# EAGLE design IMU (EAGLE 6.0)
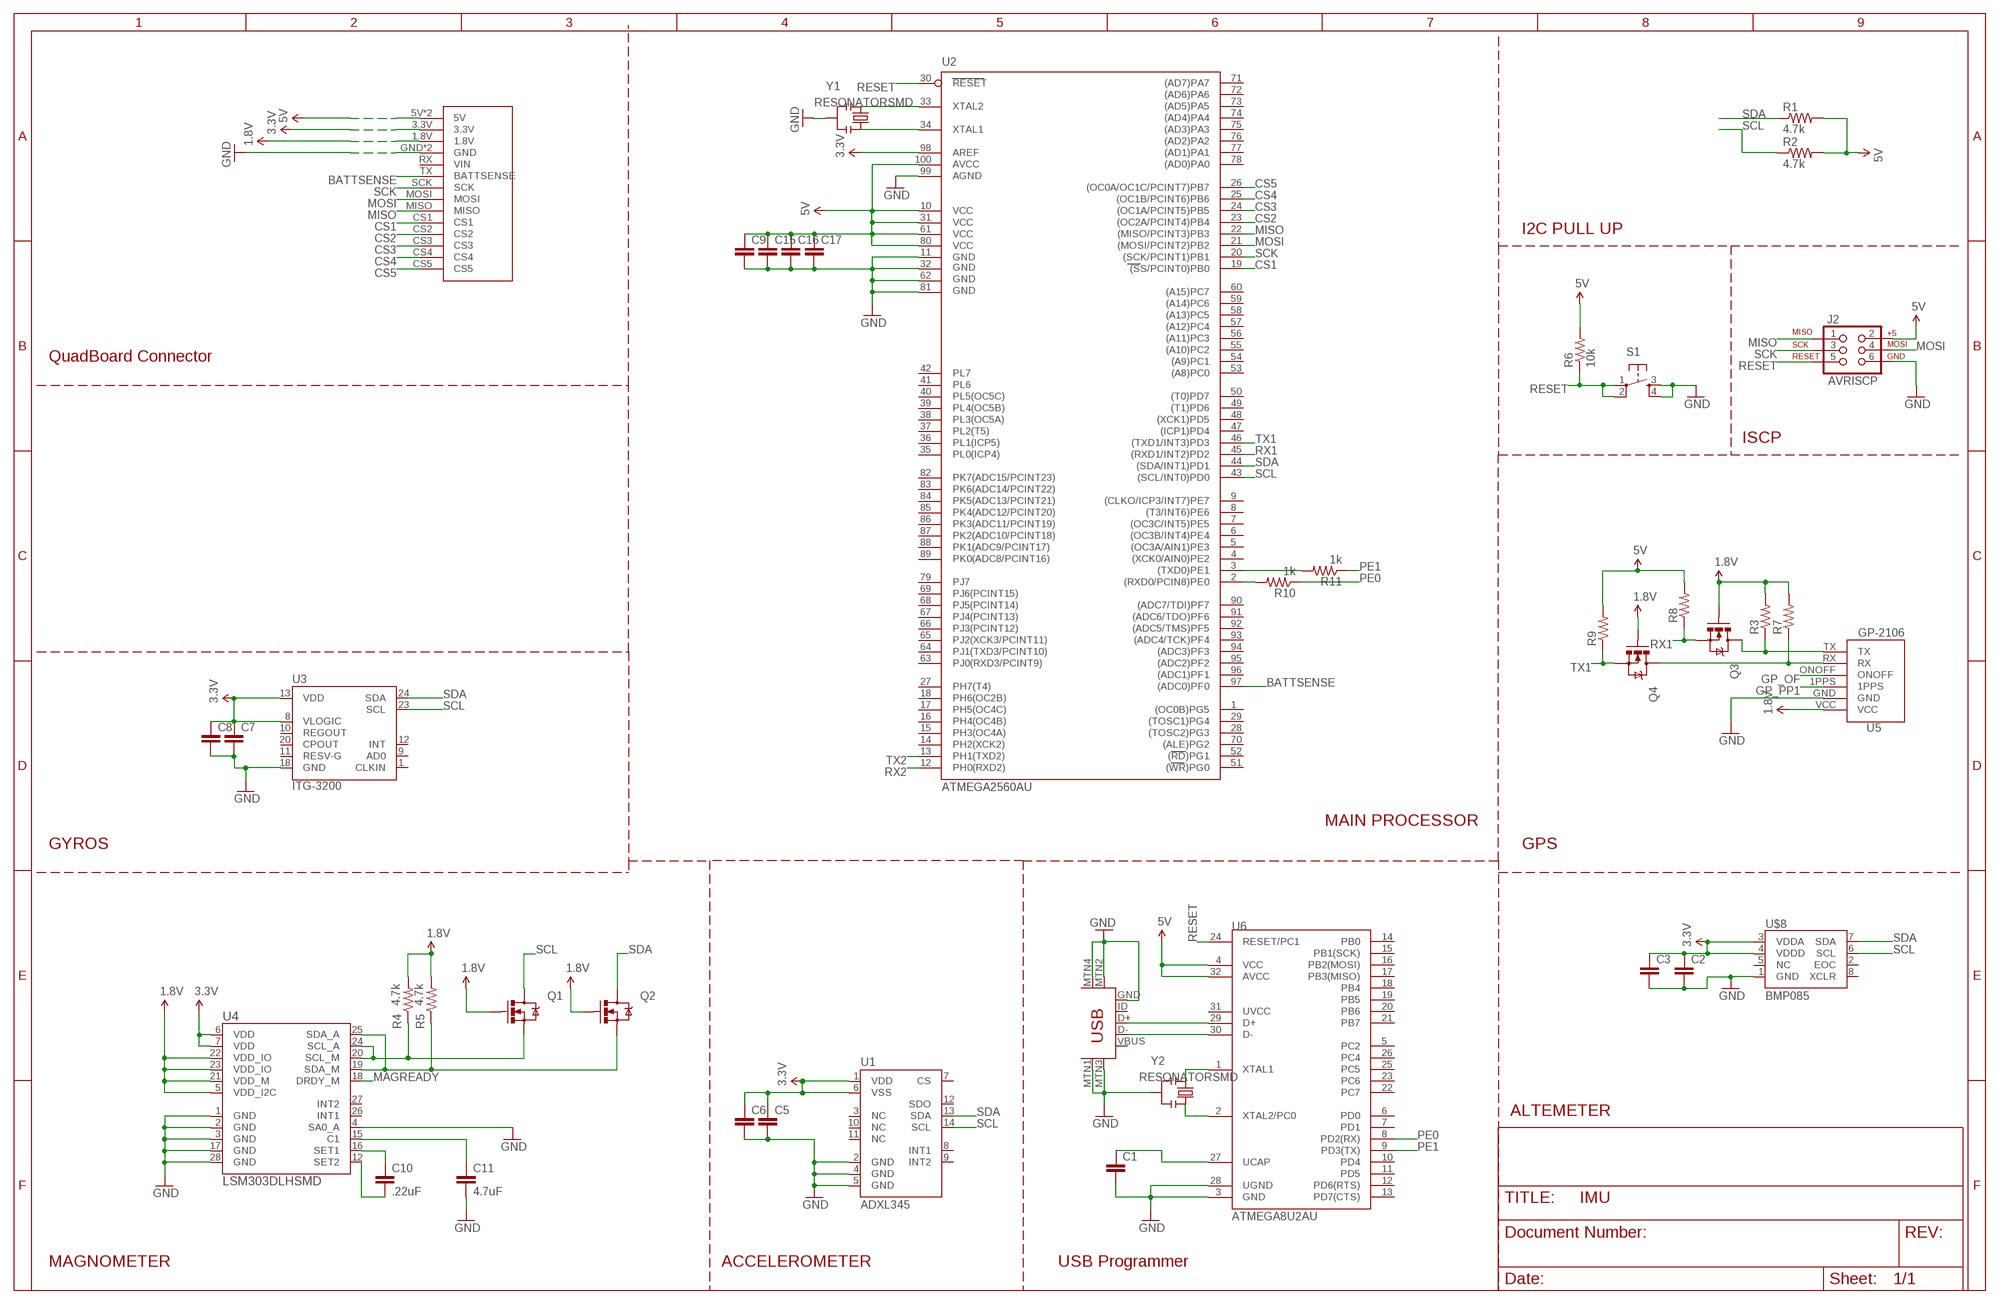
[diagram p0: schematic, sheet 1]

## Parts
C1  CAP0805  [0805]
C2  CAP0805  [0805]
C3  CAP0805  [0805]
C5  CAP0805  [0805]
C6  CAP0805  [0805]
C7  CAP0805  [0805]
C8  CAP0805  [0805]
C9  CAP0805  [0805]
C10  .22uF  CAP0805  [0805]
C11  4.7uF  CAP0805  [0805]
C15  CAP0805  [0805]
C16  CAP0805  [0805]
C17  CAP0805  [0805]
J2  AVRISCP  AVR_SPI_PRG_6PTH  [2X3]
Q1  MOSFET-NCHANNELSMD  [SOT23-3]
Q2  MOSFET-NCHANNELSMD  [SOT23-3]
Q3  MOSFET-NCHANNELSMD  [SOT23-3]
Q4  MOSFET-NCHANNELSMD  [SOT23-3]
R1  4.7k  RESISTOR0805-RES  [0805]
R2  4.7k  RESISTOR0805-RES  [0805]
R3  RESISTOR0805-RES  [0805]
R4  4.7k  RESISTOR0805-RES  [0805]
R5  4.7k  RESISTOR0805-RES  [0805]
R6  10k  RESISTOR0805-RES  [0805]
R7  RESISTOR0805-RES  [0805]
R8  RESISTOR0805-RES  [0805]
R9  RESISTOR0805-RES  [0805]
R10  1k  RESISTOR0805-RES  [0805]
R11  1k  RESISTOR0805-RES  [0805]
S1  TAC_SWITCHSMD  [TACTILE_SWITCH_SMD]
U1  ADXL345  [LGA14]
U2  ATMEGA2560AU  [TQFP100]
U3  ITG-3200  [QFN-24]
U4  LSM303DLHSMD  [LGA28-5X5]
U5  GP-2106  [GP-2106]
U6  ATMEGA8U2AU  [TQFP32-08]
U$1  USB-MINIB-5PIN  [USB-MINIB]
U$4  QUADBOARDEXT  [QUADBOARDEXT]
U$8  BMP085  [BMP085]
Y1  RESONATORSMD  [RESONATOR-SMD]
Y2  RESONATORSMD  [RESONATOR-SMD]

## Nets
1.8V: Q1.1(G) Q2.1(G) Q3.1(G) Q4.1(G) R3.2 R4.2 R5.2 R7.2 U4.5(VDD_I2C) U4.21(VDD_M) U4.22(VDD_IO) U4.23(VDD_IO) U5.VCC U$4.1.8V
3.3V: C2.1 C3.1 C5.1 C6.1 C7.1 C8.1 U1.1(VDD) U1.6(VSS) U2.98(AREF) U3.8(VLOGIC) U3.13(VDD) U4.6(VDD) U4.7(VDD) U$4.3.3V U$8.3(VDDA) U$8.4(VDDD)
5V [POWER]: C9.1 C15.1 C16.1 C17.1 J2.2 R1.2 R2.2 R6.2 R8.2 R9.2 U2.10(VCC) U2.31(VCC1) U2.61(VCC2) U2.80(VCC3) U2.100(AVCC) U6.4(VCC) U6.32(AVCC) U$4.5V U$4.5V1(5V)
BATTSENSE: U2.97((ADC0)PF0) U$4.TX(BATTSENSE)
CS1: U2.19((SS/PCINT0)PB0) U$4.CS1
CS2: U2.23((OC2A/PCINT4)PB4) U$4.CS2
CS3: U2.24((OC1A/PCINT5)PB5) U$4.CS3
CS4: U2.25((OC1B/PCINT6)PB6) U$4.CS4
CS5: U2.26((OC0A/OC1C/PCINT7)PB7) U$4.CS5
GND: C1.2 C2.2 C3.2 C5.2 C6.2 C7.2 C8.2 C9.2 C11.2 C15.2 C16.2 C17.2 J2.6 S1.3 S1.4 U1.2(GND) U1.4(GND) U1.5(GND) U2.11(GND) U2.32(GND1) U2.62(GND2) U2.81(GND3) U2.99(AGND) U3.18(GND) U4.1(GND) U4.2(GND) U4.3(GND) U4.4(SA0_A) U4.17(GND) U4.28(GND) U5.GND U6.3(GND) U6.28(UGND) U$1.GND U$1.MTN1(MTN2) U$1.MTN2(MTN3) U$1.MTN3(MTN1) U$1.MTN4 U$4.GND U$4.GND1(GND) U$8.1(GND) Y1.2 Y2.2
GP_OF: U5.ONOFF
GP_PP1: U5.1PPS
MAGREADY: U4.18(DRDY_M)
MISO: J2.1 U2.22((MISO/PCINT3)PB3) U$4.MISO
MOSI: J2.4 U2.21((MOSI/PCINT2)PB2) U$4.MOSI
N$1: Q2.2(S) R5.1 U4.19(SDA_M) U4.25(SDA_A)
N$2: Q1.2(S) R4.1 U4.20(SCL_M) U4.24(SCL_A)
N$3: C11.1 U4.15(C1)
N$4: C10.1 U4.16(SET1)
N$5: Q3.3(D) R3.1 U5.TX
N$6: Q4.3(D) R7.1 U5.RX
N$7: C10.2 U4.12(SET2)
N$8: U6.1(XTAL1) Y2.1
N$9: U2.33(XTAL2) Y1.1
N$10: U6.2(XTAL2/PC0) Y2.3
N$11: U6.30(D-) U$1.D-
N$12: U2.34(XTAL1) Y1.3
N$13: U6.29(D+) U$1.D+
N$14: R10.2 U2.2((RXD0/PCIN8)PE0)
N$15: R11.2 U2.3((TXD0)PE1)
N$16: C1.1 U6.27(UCAP)
PE0: R10.1 U6.8(PD2(RX))
PE1: R11.1 U6.9(PD3(TX))
RESET: J2.5 R6.1 S1.1 S1.2 U2.30(RESET) U6.24(RESET/PC1)
RX1: Q3.2(S) R8.1 U2.45((RXD1/INT2)PD2)
RX2: U2.12(PH0(RXD2))
SCK: J2.3 U2.20((SCK/PCINT1)PB1) U$4.SCK
SCL: Q1.3(D) R2.1 U1.14(SCL) U2.43((SCL/INT0)PD0) U3.23(SCL) U$8.6(SCL)
SDA: Q2.3(D) R1.1 U1.13(SDA) U2.44((SDA/INT1)PD1) U3.24(SDA) U$8.7(SDA)
TX1: Q4.2(S) R9.1 U2.46((TXD1/INT3)PD3)
TX2: U2.13(PH1(TXD2))
Unconnected: U1.3(NC) U1.7(CS) U1.8(INT1) U1.9(INT2) U1.10(NC) U1.11(NC) U1.12(SDO) U2.1((OC0B)PG5) U2.4((XCK0/AIN0)PE2) U2.5((OC3A/AIN1)PE3) U2.6((OC3B/INT4)PE4) U2.7((OC3C/INT5)PE5) U2.8((T3/INT6)PE6) U2.9((CLKO/ICP3/INT7)PE7) U2.14(PH2(XCK2)) U2.15(PH3(OC4A)) U2.16(PH4(OC4B)) U2.17(PH5(OC4C)) U2.18(PH6(OC2B)) U2.27(PH7(T4)) U2.28((TOSC2)PG3) U2.29((TOSC1)PG4) U2.35(PL0(ICP4)) U2.36(PL1(ICP5)) U2.37(PL2(T5)) U2.38(PL3(OC5A)) U2.39(PL4(OC5B)) U2.40(PL5(OC5C)) U2.41(PL6) U2.42(PL7) U2.47((ICP1)PD4) U2.48((XCK1)PD5) U2.49((T1)PD6) U2.50((T0)PD7) U2.51((WR)PG0) U2.52((RD)PG1) U2.53((A8)PC0) U2.54((A9)PC1) U2.55((A10)PC2) U2.56((A11)PC3) U2.57((A12)PC4) U2.58((A13)PC5) U2.59((A14)PC6) U2.60((A15)PC7) U2.63(PJ0(RXD3/PCINT9)) U2.64(PJ1(TXD3/PCINT10)) U2.65(PJ2(XCK3/PCINT11)) U2.66(PJ3(PCINT12)) U2.67(PJ4(PCINT13)) U2.68(PJ5(PCINT14)) U2.69(PJ6(PCINT15)) U2.70((ALE)PG2) U2.71((AD7)PA7) U2.72((AD6)PA6) U2.73((AD5)PA5) U2.74((AD4)PA4) U2.75((AD3)PA3) U2.76((AD2)PA2) U2.77((AD1)PA1) U2.78((AD0)PA0) U2.79(PJ7) U2.82(PK7(ADC15/PCINT23)) U2.83(PK6(ADC14/PCINT22)) U2.84(PK5(ADC13/PCINT21)) U2.85(PK4(ADC12/PCINT20)) U2.86(PK3(ADC11/PCINT19)) U2.87(PK2(ADC10/PCINT18)) U2.88(PK1(ADC9/PCINT17)) U2.89(PK0(ADC8/PCINT16)) U2.90((ADC7/TDI)PF7) U2.91((ADC6/TDO)PF6) U2.92((ADC5/TMS)PF5) U2.93((ADC4/TCK)PF4) U2.94((ADC3)PF3) U2.95((ADC2)PF2) U2.96((ADC1)PF1) U3.1(CLKIN) U3.9(AD0) U3.10(REGOUT) U3.11(RESV-G) U3.12(INT) U3.20(CPOUT) U4.26(INT1) U4.27(INT2) U6.5(PC2) U6.6(PD0) U6.7(PD1) U6.10(PD4) U6.11(PD5) U6.12(PD6(RTS)) U6.13(PD7(CTS)) U6.14(PB0) U6.15(PB1(SCK)) U6.16(PB2(MOSI)) U6.17(PB3(MISO)) U6.18(PB4) U6.19(PB5) U6.20(PB6) U6.21(PB7) U6.22(PC7) U6.23(PC6) U6.25(PC5) U6.26(PC4) U6.31(UVCC) U$1.ID U$1.VBUS U$4.RX(VIN) U$8.2(EOC) U$8.5(NC) U$8.8(XCLR)

## Notes on the sheet
- I2C PULL UP
- QuadBoard Connector
- ISCP
- MAIN PROCESSOR
- GYROS | GPS
- ALTEMETER
- MAGNOMETER | ACCELEROMETER | USB Programmer

## Library data of the parts
C1-C3 C5-C11 C15-C17 = SparkFun:CAP: Capacitor Standard 0603 ceramic capacitor, and 0.1" leaded capacitor.
J2 = SparkFun:AVR_SPI_PRG_6: AVR ISP 6 Pin This is the reduced ISP connector for AVR programming. Common on Arduino. This footprint will take up less PCB space and can be used with a 10-pin to 6-pin adapter such as SKU: BOB-08508
Q1-Q4 = SparkFun:MOSFET-NCHANNEL
R1-R11 = SparkFun:RESISTOR: Resistor Basic schematic elements and footprints for 0603, 1206, and PTH resistors.
S1 = SparkFun:TAC_SWITCH: Momentary Switch Button commonly used for reset or general input. Spark Fun Electronics SKU : COM-00097
U1 = SparkFun:ADXL345
U2 = SparkFun:ATMEGA2560: MICROCONTROLLER 64/128/256 Kbytes FLASH 4 Kbytes EEPROM 8 Kbytes SRAM 86 General Purpose I/O pins 12-channels16-bit PWM 4 x Serial USARTs 16-channels 10-bit A/D
U3 = SparkFun:ITG-3200: ITG-3200 3-axis gyro, digital output, qfn24 package
U4 = SparkFun:LSM303DLH
U5 = SparkFun:GP-2106: GP-2106 GPS SiRF IV
U6 = SparkFun:ATMEGA8U2: Atmel 8-bit Microcontroller with 8/16/32K Bystes of ISP Flash and USB Controller. ATmega8U2, ATmega16U2, and ATmega32U2
U$1 = SparkFun:USB-MINIB: Mini-USB "B" connector with 5th pin broken out. Created new symbol breaking out 5th "ID" pin in mini/micro USB connector spec. See: http://en.wikipedia.org/wiki/Mini_usb#Cables. Uses same footprint as 4-pin symbol. Also added pins to connect to mounting / shield pads if required (probably not generally needed as signals aren't shielded once they leave the connector).
U$4 = terrys:QUADBOARDEXT
U$8 = SparkFun:BMP085: BMP085 Pressure Sensor Great little MEMS pressure sensor. SKU: COM-09603
Y1 Y2 = SparkFun:RESONATOR: Resonator Small SMD resonator. This is the itty bitty 10/20MHz resonators with built in caps. CSTCE10M0G55 and CSTCE20M0V53. Footprint has been reviewed closely but hasn't been tested yet.

## Net classes
0 default: width 0.203 mm, drill 0.406 mm, clearance 0.203 mm
1 POWER: width 0.203 mm, drill 0.406 mm, clearance 0.203 mm

## Board
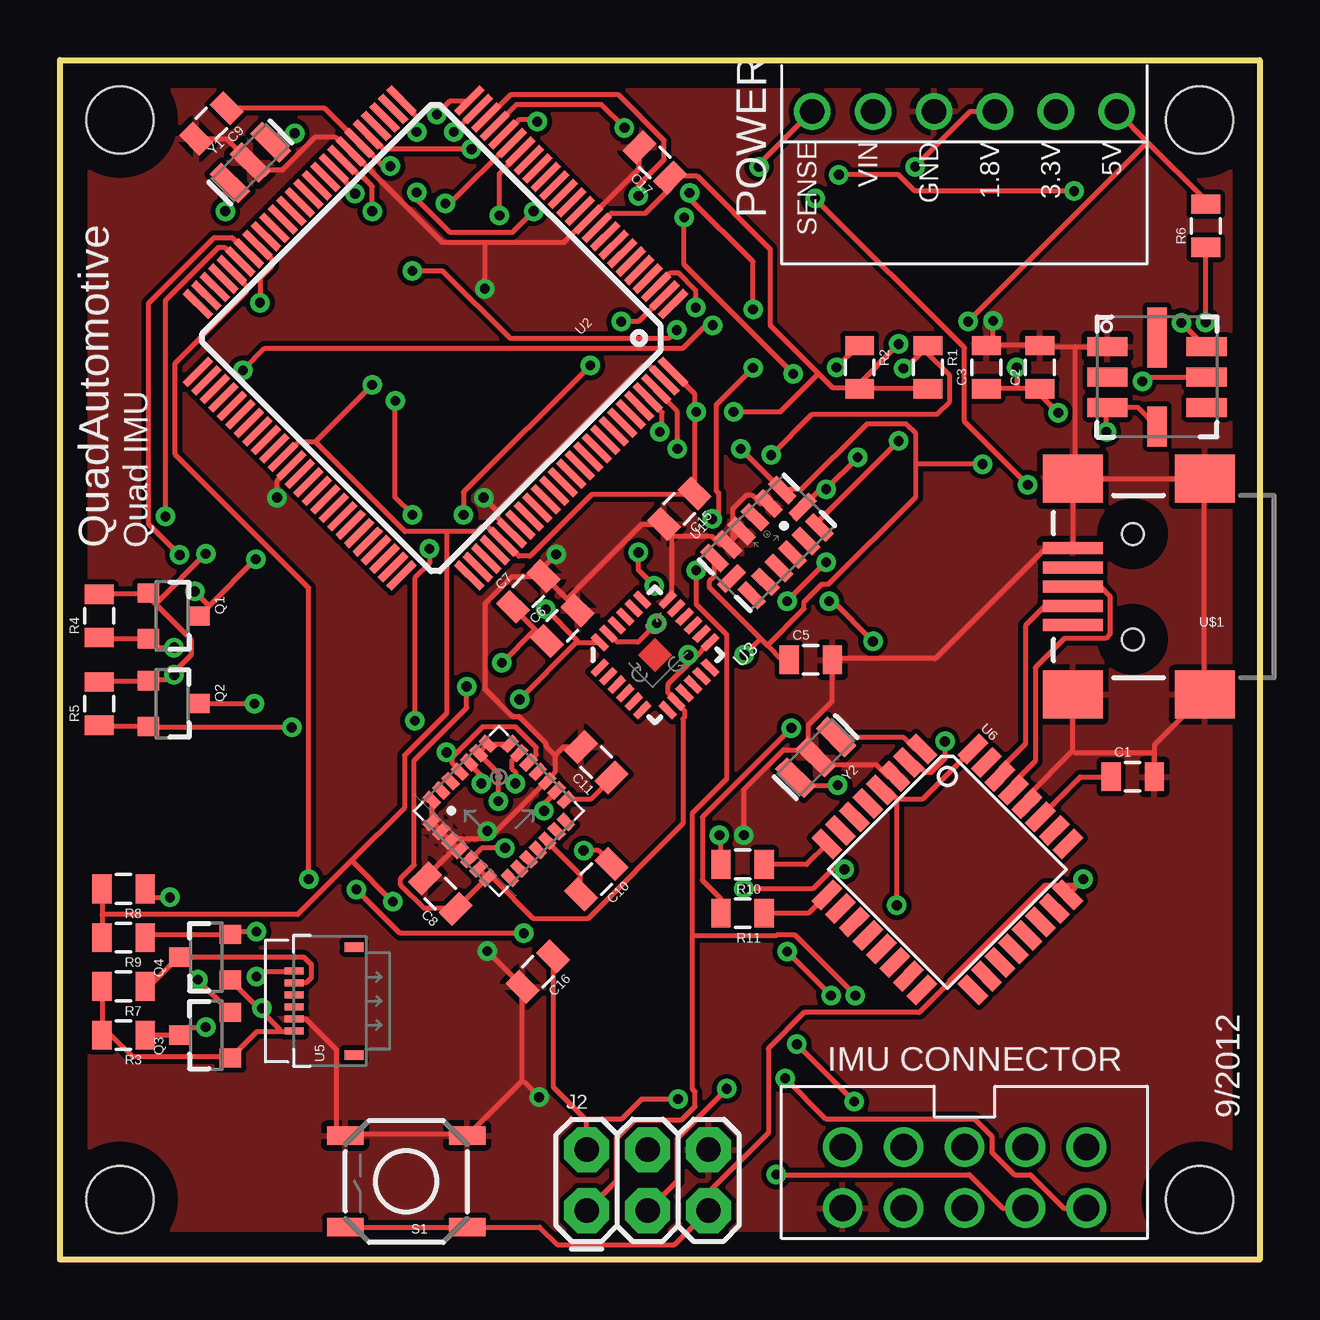
[diagram p1: board, top side]
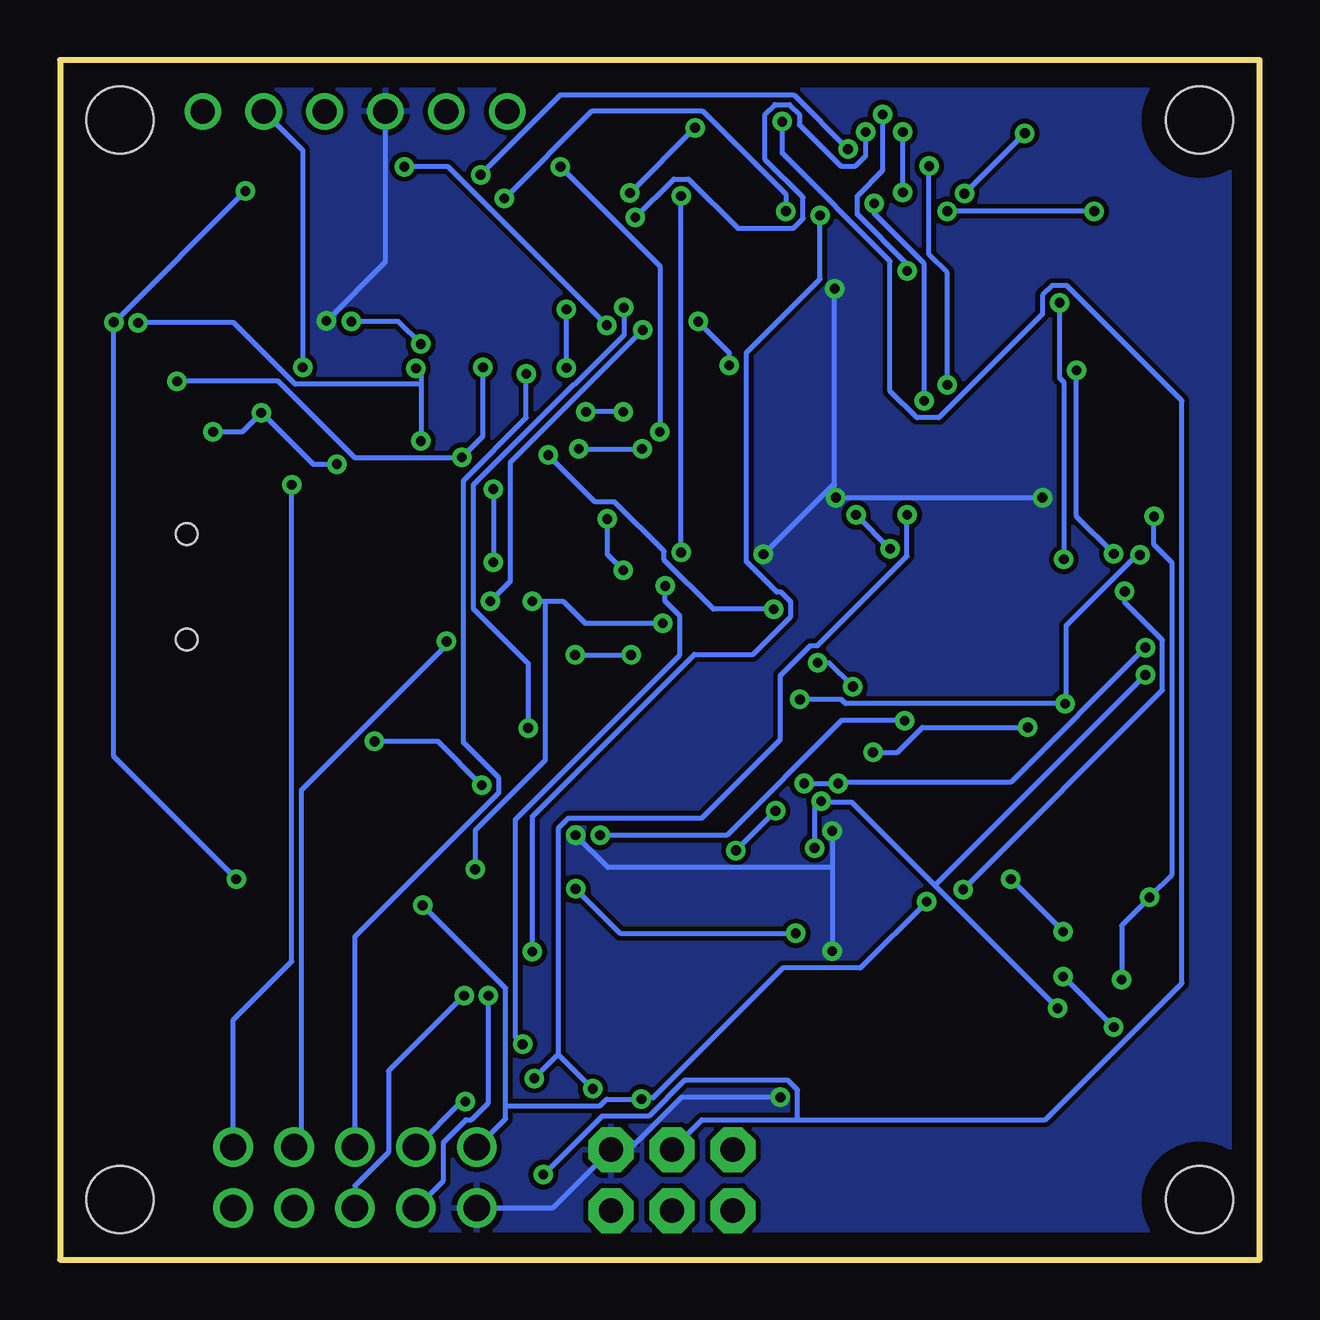
[diagram p2: board, bottom side, seen from below]

Size 50 x 50 mm. Coordinates in mm from the lower left corner, seen from the top.
Copper layers (1*16): Top 0.035mm / dielectric 1.5mm / Bottom 0.035mm
Design rules: minimum track width 8mil, minimum drill 16mil, track to track 8mil, track to pad 8mil, pad to pad 8mil, via to via 8mil, smd to smd 8mil, copper to edge 40mil, drill to drill 8mil, minimum pad ring 10mil, minimum via ring 8mil, stop-mask expansion 4mil, vias tented up to drill 16mil, thermal gap 10mil

### Footprints (pad centres in the part's own frame; a part is rotated, then mirrored left to right if it is on the bottom)
0805 = smd 0.8 x 1.2: 1 -0.9,0; 2 0.9,0
2X3 = drill 1.016 pad 1.88 octagon: 1 0,0; 2 0,2.54; 3 2.54,0; 4 2.54,2.54; 5 5.08,0; 6 5.08,2.54
SOT23-3 = smd 0.8 x 0.9: 1 -0.95,-1; 2 0.95,-1; 3 0,1.1
TACTILE_SWITCH_SMD = smd 1.524 x 0.762: 1 -2.54,1.905; 2 2.54,1.905; 3 -2.54,-1.905; 4 2.54,-1.905
LGA14 = smd 0.5 x 1.2: 1 2,1.1; 2 1.2,1.1; 3 0.4,1.1; 4 -0.4,1.1; 5 -1.2,1.1; 6 -2,1.1; 8 -2,-1.1; 9 -1.2,-1.1; 10 -0.4,-1.1; 11 0.4,-1.1; 12 1.2,-1.1; 13 2,-1.1 | smd 1.2 x 0.5: 7 -2.1,0; 14 2.1,0
TQFP100 = smd 1.5 x 0.3: 1 -8,6; 2 -8,5.5; 3 -8,5; 4 -8,4.5; 5 -8,4; 6 -8,3.5; 7 -8,3; 8 -8,2.5; 9 -8,2; 10 -8,1.5; 11 -8,1; 12 -8,0.5; 13 -8,0; 14 -8,-0.5; 15 -8,-1; 16 -8,-1.5; 17 -8,-2; 18 -8,-2.5; 19 -8,-3; 20 -8,-3.5; 21 -8,-4; 22 -8,-4.5; 23 -8,-5; 24 -8,-5.5; 25 -8,-6; 51 8,-6; 52 8,-5.5; 53 8,-5; 54 8,-4.5; 55 8,-4; 56 8,-3.5; 57 8,-3; 58 8,-2.5; 59 8,-2; 60 8,-1.5; 61 8,-1; 62 8,-0.5; 63 8,0; 64 8,0.5; 65 8,1; 66 8,1.5; 67 8,2; 68 8,2.5; 69 8,3; 70 8,3.5; 71 8,4; 72 8,4.5; 73 8,5; 74 8,5.5; 75 8,6 | smd 0.3 x 1.5: 26 -6,-8; 27 -5.5,-8; 28 -5,-8; 29 -4.5,-8; 30 -4,-8; 31 -3.5,-8; 32 -3,-8; 33 -2.5,-8; 34 -2,-8; 35 -1.5,-8; 36 -1,-8; 37 -0.5,-8; 38 0,-8; 39 0.5,-8; 40 1,-8; 41 1.5,-8; 42 2,-8; 43 2.5,-8; 44 3,-8; 45 3.5,-8; 46 4,-8; 47 4.5,-8; 48 5,-8; 49 5.5,-8; 50 6,-8; 76 6,8; 77 5.5,8; 78 5,8; 79 4.5,8; 80 4,8; 81 3.5,8; 82 3,8; 83 2.5,8; 84 2,8; 85 1.5,8; 86 1,8; 87 0.5,8; 88 0,8; 89 -0.5,8; 90 -1,8; 91 -1.5,8; 92 -2,8; 93 -2.5,8; 94 -3,8; 95 -3.5,8; 96 -4,8; 97 -4.5,8; 98 -5,8; 99 -5.5,8; 100 -6,8
QFN-24 = smd 0.8 x 0.3: 1 -2,1.25; 2 -2,0.75; 3 -2,0.25; 4 -2,-0.25; 5 -2,-0.75; 6 -2,-1.25; 13 2,-1.25; 14 2,-0.75; 15 2,-0.25; 16 2,0.25; 17 2,0.75; 18 2,1.25 | smd 0.3 x 0.8: 7 -1.25,-2; 8 -0.75,-2; 9 -0.25,-2; 10 0.25,-2; 11 0.75,-2; 12 1.25,-2; 19 1.25,2; 20 0.75,2; 21 0.25,2; 22 -0.25,2; 23 -0.75,2; 24 -1.25,2
LGA28-5X5 = smd 0.7 x 0.4: 1 -2.3,1.65; 2 -2.3,1.1; 3 -2.3,0.55; 4 -2.3,0; 5 -2.3,-0.55; 6 -2.3,-1.1; 7 -2.3,-1.65; 15 2.3,-1.65; 16 2.3,-1.1; 17 2.3,-0.55; 18 2.3,0; 19 2.3,0.55; 20 2.3,1.1; 21 2.3,1.65 | smd 0.4 x 0.7: 8 -1.65,-2.3; 9 -1.1,-2.3; 10 -0.55,-2.3; 11 0,-2.3; 12 0.55,-2.3; 13 1.1,-2.3; 14 1.65,-2.3; 22 1.65,2.3; 23 1.1,2.3; 24 0.55,2.3; 25 0,2.3; 26 -0.55,2.3; 27 -1.1,2.3; 28 -1.65,2.3
GP-2106 = smd 0.3 x 0.8: 1PPS -0.25,0; GND -0.75,0; ONOFF 0.25,0; RX 0.75,0; TX 1.25,0; VCC -1.25,0 | smd 0.4 x 0.8: P$7 -2.25,-2.5; P$8 2.25,-2.5
TQFP32-08 = smd 1.27 x 0.559: 1 -4.293,2.8; 2 -4.293,2; 3 -4.293,1.2; 4 -4.293,0.4; 5 -4.293,-0.4; 6 -4.293,-1.2; 7 -4.293,-2; 8 -4.293,-2.8; 17 4.293,-2.8; 18 4.293,-2; 19 4.293,-1.2; 20 4.293,-0.4; 21 4.293,0.4; 22 4.293,1.2; 23 4.293,2; 24 4.293,2.8 | smd 0.559 x 1.27: 9 -2.8,-4.293; 10 -2,-4.293; 11 -1.2,-4.293; 12 -0.4,-4.293; 13 0.4,-4.293; 14 1.2,-4.293; 15 2,-4.293; 16 2.8,-4.293; 25 2.8,4.293; 26 2,4.293; 27 1.2,4.293; 28 0.4,4.293; 29 -0.4,4.293; 30 -1.2,4.293; 31 -2,4.293; 32 -2.8,4.293
USB-MINIB = smd 2.5 x 0.5: D+ 2.5,0; D- 2.5,0.8; GND 2.5,-1.6; ID 2.5,-0.8; VBUS 2.5,1.6 | smd 2.5 x 2: MTN1 -3,4.5; MTN2 2.5,4.5; MTN3 -3,-4.5; MTN4 2.5,-4.5 | hole 0.9: 0,2.2; 0,-2.2
QUADBOARDEXT = drill 1.016: 1.8V 13.97,22.86; 3.3V 16.51,22.86; 5V 19.05,22.86; GND 11.43,22.86; RX 8.89,22.86; TX 6.35,22.86 | drill 1.1: 5V1 7.62,-20.32; CS1 10.16,-22.86; CS2 10.16,-20.32; CS3 12.7,-20.32; CS4 15.24,-20.32; CS5 17.78,-20.32; GND1 7.62,-22.86; MISO 12.7,-22.86; MOSI 15.24,-22.86; SCK 17.78,-22.86 | hole 2.8: -22.5,22.5; 22.5,22.5; 22.5,-22.5; -22.5,-22.5
BMP085 = smd 1.67 x 0.8: 1 -2.065,1.27; 2 -2.065,0; 3 -2.065,-1.27; 5 2.065,-1.27; 6 2.065,0; 7 2.065,1.27 | smd 0.8 x 1.67: 4 0,-2.065 | smd 0.8 x 2.5: 8 0,1.65
RESONATOR-SMD = smd 0.7 x 1.7: 1 -1.2,0; 2 0,0; 3 1.2,0

### Placement (x,y rotation side)
C1  44.71,20.12 0 top
C2  40.85,37.19 90 top
C3  38.61,37.19 90 top
C5  31.3,25 0 top
C6  20.94,26.42 45 top
C7  19.51,27.84 45 top
C8  15.86,15.25 135 top
C9  6.31,47.35 225 top
C10  22.36,15.86 225 top
C11  22.36,20.73 135 top
C15  25.81,31.3 225 top
C16  19.92,12 225 top
C17  24.8,45.73 135 top
J2  21.95,2.04 0 top
Q1  4.68,26.83 270 top
Q2  4.68,23.17 270 top
Q3  6.1,9.35 90 top
Q4  6.1,12.6 90 top
R1  36.18,37.19 270 top
R2  33.33,37.19 270 top
R3  2.65,9.35 180 top
R4  1.63,26.83 90 top
R5  1.63,23.17 90 top
R6  47.76,43.08 90 top
R7  2.65,11.39 180 top
R8  2.65,15.45 180 top
R9  2.65,13.42 180 top
R10  28.45,16.47 180 top
R11  28.45,14.43 180 top
S1  14.43,3.26 180 top
U1  29.47,29.88 45 top
U2  15.65,38.41 225 top
U3  24.8,25.2 45 top
U4  18.29,18.7 45 top
U5  9.76,10.78 90 top
U6  36.99,16.26 315 top
U$1  44.71,28.05 180 top
U$4  25,25 0 top
U$8  45.73,36.79 0 top
Y1  7.93,45.73 45 top
Y2  31.5,20.94 225 top

### Tracks (layer width: path | path; a pad name or v marks a point on that pad's centre or on a via)
1.8V  (via drill 0.41)
  Top 0.203: v18.55,17.15 17.58,17.15 17.13,16.69 17.08,16.69 U4.5 | v18.27,19.11 18.27,20.28 17.46,21.09 U4.23 17.51,21.16 17.81,21.47 U4.22 17.91,21.49 U4.21 | R7.2 1.76,11.39 1.76,9.35 R3.2 1.84,9.3 2.17,9.3 3.03,8.44 7.02,8.44 Q3.1 7.12,8.41 8.21,9.51 9.18,9.51 | 9.18,9.51 9.76,9.51 U5.VCC | 8.35,10.41 9.18,9.58 9.18,9.51 | 8.35,10.41 7.12,11.64 Q4.1 | v8.41,10.47 8.35,10.41 | R5.2 1.63,24.09 1.66,24.11 3.66,24.11 Q2.1 3.77,24.16 4.43,24.16 4.69,24.43 | Q1.1 3.66,27.77 1.66,27.77 1.63,27.74 R4.2 | 4.69,24.43 5.47,25.2 5.47,25.84 3.61,27.69 Q1.1 | U$4.1.8V 37.95,47.86 v35.64,45.55 | v27.21,38.94 26.93,38.94 25.97,37.98 8.54,37.98 v7.63,37.06 | v6.08,29.42 4.05,27.39 Q1.1 | v4.76,24.36 4.69,24.43
  Bottom 0.203: v18.55,17.15 18.55,18.83 v18.27,19.11 18.19,19.06 17,19.06 13.53,15.59 | v8.41,10.47 13.53,15.59 | v35.64,45.55 33.81,45.55 v27.21,38.94 | v7.63,37.06 7.63,30.97 v6.08,29.42 | v4.76,24.36 13.53,15.59
3.3V  (via drill 0.41)
  Top 0.203: 19.81,26.26 20.28,25.79 C6.1 | 19.81,26.26 18.88,27.18 C7.1 | U4.7 17.81,15.93 17.46,16.29 U4.6 | U4.7 17.76,15.86 16.52,14.61 C8.1 16.39,14.64 15.17,14.64 14.21,15.6 14.21,15.88 14.76,16.44 14.76,20.81 16.95,22.99 v16.95,23.88 | 26.38,25.01 27.08,25.71 U3.13 | 26.38,25.01 25.33,23.96 25.33,23.65 25.66,23.32 25.66,23.27 U3.8 25.74,23.17 26.04,22.87 26.04,22.61 25.97,22.54 25.97,18.17 22,14.2 19.74,14.2 18.09,15.86 17.91,15.86 U4.7 | v18.42,24.87 19.81,26.26 | C5.1 30.08,25 29.48,25.6 | 29.2,25.88 27.06,28.02 27.06,28.25 27.26,28.45 27.26,29.22 U1.6 | 29.2,25.88 29.48,25.6 | 35.67,33.15 35.67,31.78 32.04,28.15 31.76,28.15 31.02,27.41 31.02,27.13 29.48,25.6 | 35.67,33.15 35.67,34.42 35.26,34.83 33.64,34.83 30.89,32.09 30.13,32.09 U1.1 30.03,32.14 v28.38,33.79 | v25.74,33.79 25.74,35.34 24.85,36.23 24.85,36.28 U2.98 | U$8.4 44.94,35.52 U$8.3 43.62,35.44 v43.62,34.5 | 39.88,36.3 40.85,36.3 C2.1 40.67,36.23 v41.61,35.29 | 39.88,36.3 38.61,36.3 C3.1 | v39.88,37.19 39.88,36.3 | v38.46,33.15 35.67,33.15 | v26.19,25.2 26.38,25.01 | 29.2,25.88 v28.53,25.2
  Bottom 0.203: v18.42,24.87 17.94,24.87 v16.95,23.88 | v28.38,33.79 v25.74,33.79 | v39.88,37.19 39.88,46.23 U$4.3.3V | v43.62,34.5 42.4,34.5 v41.61,35.29 41.54,35.24 39.45,33.15 v38.46,33.15 | v28.53,25.2 v26.19,25.2
5V  (via drill 0.41)
  Top 0.203: R6.2 47.76,44.15 45.33,46.58 | U$4.5V 45.33,46.58 | R2.2 33.33,36.3 36.18,36.3 R1.2 | U2.10 22.38,43.01 22.99,43.62 24.42,43.62 25.43,44.63 25.43,45.07 C17.1 25.48,45.17 26.55,45.17 29.6,42.12 29.6,38.94 31.62,36.93 | 31.62,36.93 32.19,36.35 33.26,36.35 R2.2 | v37.85,39.1 45.33,46.58 | v34.96,38.16 33.26,36.46 R2.2 | 21.95,5.8 20.58,7.17 20.58,12.63 C16.1 | J2.2 21.95,5.8 | 34.93,19.18 34.55,19.56 34.25,19.56 U6.4 | 34.93,19.18 35.95,19.18 38.03,21.27 U6.32 | v34.88,14.76 34.88,19.11 34.93,19.18 | v25.76,6.69 24.24,6.69 23.4,5.85 22.03,5.85 21.95,5.8 | C9.1 6.97,47.99 11.03,47.99 12.45,46.56 U2.31 12.55,46.49 13.47,45.57 v13.77,45.57 | 1.76,14.38 1.76,15.45 R8.2 | 1.76,14.38 1.76,13.42 R9.2 | 26.45,35.34 26.45,36.1 U2.100 | 26.45,35.34 26.45,31.96 C15.1 26.37,31.88 22.16,31.88 19.59,29.32 19.13,29.32 18.55,29.9 18.5,29.9 U2.80 18.4,29.98 17.84,30.54 17.58,30.54 17.38,30.33 16.11,30.33 | 10.65,34.07 9.94,34.07 9.35,33.48 9.3,33.48 U2.61 | 10.65,34.07 14.38,30.33 16.11,30.33 | 1.76,14.38 9.91,14.38 12.16,16.63 | 12.16,16.63 14.36,18.83 14.36,21.01 16.11,22.76 16.11,30.33 | v13.01,36.46 10.7,34.14 10.65,34.07 | 12.16,16.63 v13.87,14.92 | 31.62,36.93 30.03,35.34 v28.07,35.34 | v26.52,35.34 26.45,35.34
  Bottom 0.203: v37.85,39.1 35.9,39.1 v34.96,38.16 | v34.88,14.76 31.43,11.31 31.43,6.41 | 31.43,6.41 31.43,5.87 U$4.5V1 | 31.43,6.41 27.49,6.41 27.21,6.69 v25.76,6.69 25.69,6.74 25.28,6.74 19.87,12.15 16.64,12.15 v13.87,14.92 | v13.77,45.57 13.77,41.89 13.01,41.13 v13.01,36.46 | v26.52,35.34 v28.07,35.34
BATTSENSE  (via drill 0.41)
  Top 0.203: v25,34.5 25.1,34.6 25.1,35.31 24.49,35.92 U2.97 | v29.14,45.55 29.14,45.65 U$4.TX
  Bottom 0.203: v25,34.5 25,41.41 v29.14,45.55
CS1  (via drill 0.41)
  Top 0.203: v18.32,43.52 18.32,45.27 19.18,46.13 U2.19 | v32.14,11 v30.31,12.83
  Bottom 0.203: v18.32,43.52 18.32,40.87 21.39,37.8 21.39,29.09 20.12,27.82 19.95,27.82 19.54,27.41 19.54,26.8 21.11,25.23 23.55,25.23 30.31,18.47 v30.31,12.83 | v32.14,11 32.14,6.53 32.85,5.82 33.08,5.82 34.02,4.88 34.02,3.28 U$4.CS1
CS2  (via drill 0.41)
  Top 0.203: v24.11,44.33 24.11,44.79 25.18,45.85 25.18,46.64 23.27,48.55 18.78,48.55 17.84,47.61 U2.23 | v24.11,29.47 24.11,28.73 v24.77,28.07 | v33.1,6.58 v30.72,8.97
  Bottom 0.203: v24.11,29.47 v24.11,44.33 | v24.77,28.07 24.77,27.44 24.16,26.83 24.16,25.2 31.02,18.35 31.02,9.28 v30.72,8.97 | v33.1,6.58 33.26,6.58 U$4.CS2
CS3  (via drill 0.41)
  Top 0.203: v16.41,47 17.35,47.94 17.41,47.94 U2.24 | v26.02,43.44 26.02,41.46 v30.56,36.91
  Bottom 0.203: v16.41,47 16.41,46.01 16.85,45.57 17.46,45.57 19.18,47.3 19.18,47.73 19.59,48.14 20.2,48.14 20.61,47.73 20.61,45.85 19.03,44.28 19.03,43.39 19.44,42.98 21.75,42.98 23.81,45.04 24.42,45.04 v26.02,43.44 | v30.56,36.91 30.56,35.08 33.18,32.47 33.18,21.55 31.71,20.07 31.71,19.46 37.7,13.47 U$4.CS3
CS4  (via drill 0.41)
  Top 0.203: v15.7,47.73 16.26,48.29 17.05,48.29 U2.25 | v14.69,41.21 15.96,41.21 18.78,38.39 25.36,38.39 v25.71,38.74 | v32.06,27.44 32.21,27.44 v33.89,25.76
  Bottom 0.203: v15.7,47.73 15.7,45.4 16.77,44.33 16.77,43.57 14.69,41.48 v14.69,41.21 | v25.71,38.74 31.22,33.23 31.22,28.28 v32.06,27.44 | v33.89,25.76 33.89,25.61 39.94,19.56 39.94,4.98 U$4.CS4
CS5  (via drill 0.41)
  Top 0.203: v14.87,47 14.87,47.63 14.26,48.24 14.26,48.29 U2.26 | v14.87,44.48 14.87,44.2 16.26,42.81 18.85,42.81 v19.74,43.69 | v31.48,44.23 37.7,38 37.7,34.93 v40.34,32.29
  Bottom 0.203: v14.87,44.48 v14.87,47 | v19.74,43.69 19.74,44.41 23.22,47.89 27.82,47.89 v31.48,44.23 | v40.34,32.29 40.34,12.43 42.78,9.99 U$4.CS5
GND  (via drill 0.41)
  Top 0.203: U$8.1 42.32,38.06 | 42.32,38.06 40.93,38.06 C2.2 40.85,38.11 38.61,38.11 C3.2 38.89,38.18 v38.89,39.12 | 45.62,21.14 45.62,21.44 47.71,23.53 U$1.MTN1 47.68,23.65 47.68,32.44 U$1.MTN3 42.32,32.54 U$1.MTN4 | 45.62,21.14 45.62,20.12 C1.2 | 42.2,21.19 40.32,19.31 40.32,19.03 U6.28 | 42.2,21.19 42.2,23.53 U$1.MTN2 | 45.62,21.14 42.27,21.14 42.2,21.19 | Y2.2 31.2,21.24 31.2,22.28 32.19,23.27 C5.2 32.29,25.05 36.48,25.05 41.03,29.6 42.12,29.6 U$1.GND 42.22,29.65 42.22,32.54 U$1.MTN4 | U6.3 34.78,20.15 34.5,20.15 34.02,20.63 31.83,20.63 31.58,20.89 Y2.2 | 42.32,38.06 42.32,32.65 U$1.MTN4 | U5.GND 9.76,10.01 10.27,10.01 11.54,8.74 11.54,5.52 S1.4 11.97,5.21 16.9,5.21 S1.3 19.26,7.45 | 19.26,7.45 19.26,11.33 C16.2 19.23,11.44 v17.81,12.86 | v19.97,6.76 19.34,7.4 19.26,7.45 | U4.3 16.26,17.48 15.96,17.79 U4.2 15.88,17.86 15.53,18.22 U4.1 15.5,18.32 U4.28 | U4.3 16.31,17.41 16.64,17.08 U4.4 16.47,17.15 15.22,15.91 C8.2 | 18,17.67 17.89,17.56 16.31,17.56 U4.3 | 18,17.67 20.25,19.92 20.3,19.92 U4.17 20.35,20.02 20.63,20.3 20.63,21.01 | 28.11,30.09 28.4,30.38 U1.4 | 28.11,30.09 27.84,29.83 U1.5 27.74,29.83 27.49,29.83 27.16,30.16 25.48,30.16 | U1.2 29.52,31.53 29.19,31.53 28.86,31.86 28.61,31.86 28.05,31.3 28.05,30.16 28.11,30.09 | 21.13,27.53 21.57,27.08 C6.2 | 21.13,27.53 20.17,28.48 C7.2 | 25.48,30.16 25.48,30.33 25.18,30.64 C15.2 25.08,30.64 24.24,30.64 21.13,27.53 | 25.48,30.16 25.48,27.77 25.33,27.62 25.33,27.51 U3.18 | 20.63,21.01 20.25,21.39 20.25,21.52 19.13,22.64 18.85,22.64 17.71,23.78 17.71,27.34 18.83,28.45 20.05,28.45 C7.2 | C17.2 24.14,46.36 24.14,45.47 22.03,43.36 U2.11 21.93,43.31 21.01,42.4 17.71,42.4
  Top 0.203: C9.2 5.67,46.69 6.97,46.69 Y1.2 8.01,45.68 8.26,45.42 9.28,45.42 10.65,46.79 11.46,46.79 12.05,46.21 12.1,46.21 U2.32 12.2,46.13 15.93,42.4 17.71,42.4 | 18.24,31.2 18.24,30.92 18.83,30.33 U2.81 | 18.24,31.2 24.29,37.24 24.59,37.24 25.18,36.66 U2.99 | v9.05,31.76 9.05,32.47 9.63,33.05 9.63,33.1 U2.62 | v17.66,31.76 18.17,31.25 18.24,31.2 | v17.71,40.47 17.71,42.4 | v20.68,29.39 20.17,28.89 20.17,28.58 C7.2 | 18,17.67 v17.81,17.86 | v28.51,17.68 28.51,19.59 30.16,21.24 31.12,21.24 Y2.2 | C11.2 20.99,21.37 20.63,21.01
  Bottom 0.203: U$4.GND 36.43,41.59 v38.89,39.12 | U$4.GND1 29.47,2.14 J2.6 26.96,4.63 26.22,4.63 24.09,6.76 v19.97,6.76 | v9.05,31.76 v17.66,31.76 17.71,31.83 17.71,32.29 | 17.71,32.29 v17.71,40.47 | v20.68,29.39 17.79,32.29 17.71,32.29 | v17.81,17.86 17.81,16.34 | 17.81,16.34 v17.81,12.86 | v28.51,17.68 27.16,16.34 17.81,16.34
  pour Top: 0.01,49.79 49.99,49.79 49.99,0.01 0.01,0.01
  pour Bottom: 0.01,49.79 49.99,49.79 49.99,0.01 0.01,0.01
MISO  (via drill 0.41)
  Top 0.203: v23.53,47.17 22.56,48.14 19.03,48.14 18.14,47.25 U2.22 | v26.24,44.46 26.24,44.23 28.89,41.59 v28.89,39.6 | v28.89,37.17 27.36,35.64 27.36,32.04 27.46,31.93 27.46,31.15 v27.18,30.87 | v26.52,28.73 26.52,27.31 27.79,26.04 27.79,20.05 26.37,18.62 26.37,13.52 | 26.37,13.52 26.37,7.09 26.47,6.99 26.47,6.38 25.91,5.82 23.96,5.82 23.2,5.06 23.2,3.28 J2.1 | v33.15,11 30.61,13.54 29.9,13.54 29.88,13.52 26.37,13.52
  Bottom 0.203: v26.24,44.46 v23.53,47.17 | v28.89,37.17 v28.89,39.6 | v27.18,30.87 27.18,29.39 v26.52,28.73 | U$4.MISO 37.7,3.08 36.3,4.48 36.3,7.85 v33.15,11
MOSI  (via drill 0.41)
  Top 0.203: v19.89,47.43 19.82,47.5 19.13,47.5 18.55,46.92 18.5,46.92 U2.21 | U$4.MOSI 39.3,2.14 37.9,3.54 v29.85,3.54
  Bottom 0.203: v19.89,47.43 19.89,46.11 15.4,41.61 15.4,36.2 14.28,35.08 13.37,35.08 9.05,39.4 9.05,40.19 8.64,40.6 8.03,40.6 3.23,35.79 3.23,11.51 8.92,5.82 19.26,5.82 | 19.26,5.82 23.25,5.82 J2.4 | v29.85,3.54 27.41,5.98 25.46,5.98 23.96,7.47 19.67,7.47 19.26,7.07 19.26,5.82
N$1  (via drill 0.41)
  Top 0.203: R5.1 1.63,22.26 1.66,22.23 3.66,22.23 Q2.2 3.77,22.18 v9.66,22.18 | 16.34,20.94 16.34,20.71 16.64,20.4 16.64,20.35 U4.25 | 16.34,20.94 17.61,22.21 18.98,22.21 19.84,21.34 19.84,21.04 19.54,20.73 U4.19 | v16.11,21.14 16.26,20.99 16.34,20.94
  Bottom 0.203: v9.66,22.18 14.05,22.18 15.09,21.14 v16.11,21.14
N$2  (via drill 0.41)
  Top 0.203: v17.56,19.84 17.56,20.17 17.08,20.66 17.08,20.71 U4.24 | v18.98,19.84 18.98,20.33 18.83,20.48 18.83,20.78 19.13,21.09 U4.20 | R4.1 1.63,25.91 1.66,25.89 3.66,25.89 Q1.2 3.77,25.84 4.1,25.51 v4.76,25.51
  Bottom 0.203: v18.98,19.84 v17.56,19.84 17.48,19.89 10.37,19.89 v4.76,25.51
N$3
  Top 0.203: U4.15 21.09,19.18 22.1,19.18 22.99,20.07 C11.1
N$4  (via drill 0.41)
  Top 0.203: v20.17,18.7 20.17,18.98 20.68,19.49 20.68,19.54 U4.16 | v21.83,17.05 22.46,17.05 22.99,16.52 C10.1
  Bottom 0.203: v21.83,17.05 v20.17,18.7
N$5  (via drill 0.41)
  Top 0.203: v8.19,11.79 8.41,12.02 U5.TX | v6.08,9.68 5.34,9.68 Q3.3 R3.1
  Bottom 0.203: v6.08,9.68 v8.19,11.79
N$6
  Top 0.203: U5.RX 10.27,11.54 10.47,11.74 10.47,12.3 10.17,12.6 Q4.3 4.91,12.58 3.71,11.39 R7.1
N$7
  Top 0.203: U4.12 20.33,17.46 20.33,17.41 21.7,16.03 21.7,15.22 C10.2
N$8
  Top 0.203: U6.1 35.92,21.29 35.62,21.29 35.13,21.77 32.37,21.77 Y2.1
N$9  (via drill 0.41)
  Top 0.203: v13.01,43.69 13.01,44.74 12.6,45.14 12.5,45.14 11.82,45.83 11.77,45.83 U2.33 | v6.89,43.69 6.89,44.68 Y1.1
  Bottom 0.203: v6.89,43.69 v13.01,43.69
N$10  (via drill 0.41)
  Top 0.203: v36.89,21.6 36.89,20.89 36.3,20.3 36.07,20.3 35.67,20.71 35.39,20.71 U6.2 | v32.42,19.77 30.97,19.77 30.66,20.07 Y2.3
  Bottom 0.203: v36.89,21.6 34.25,21.6 v32.42,19.77
N$11
  Top 0.203: U6.30 39.2,20.15 39.2,20.45 40.24,21.49 40.24,26.42 41.05,27.24 42.2,27.24 U$1.D-
N$12  (via drill 0.41)
  Top 0.203: v12.3,44.43 12.3,44.53 11.41,45.42 U2.34 | v9.79,46.95 9.15,46.95 Y1.3
  Bottom 0.203: v9.79,46.95 v12.3,44.43
N$13
  Top 0.203: U$1.D+ 43.36,28.05 43.77,27.64 43.77,26.07 43.59,25.89 41.87,25.89 40.65,24.67 40.65,20.78 39.76,19.89 39.76,19.59 U6.29
N$14  (via drill 0.41)
  Top 0.203: v27.49,17.68 27.54,17.63 27.54,16.47 R10.2 | v14.79,22.46 14.79,28.4 15.4,29.01 v15.4,29.62 | v16.82,31.05 16.82,31.98 v22.1,37.27 | v23.4,39.1 24.11,39.1 25.18,40.16 U2.2
  Bottom 0.203: v27.49,17.68 22.21,17.68 17.43,22.46 v14.79,22.46 | v16.82,31.05 v15.4,29.62 | v22.1,37.27 22.1,37.8 v23.4,39.1
N$15  (via drill 0.41)
  Top 0.203: v30.49,22.16 26.78,18.45 26.78,15.81 27.54,15.04 27.54,14.43 R11.2 | v26.5,39.68 26.5,40.39 25.76,41.13 25.43,41.13 24.85,40.54 U2.3
  Bottom 0.203: v30.49,22.16 30.49,24.85 32.77,27.13 32.77,32.29 28.61,36.46 28.58,36.46 26.5,38.54 v26.5,39.68
N$16
  Top 0.203: C1.1 42.53,20.12 40.88,18.47 U6.27
PE0
  Top 0.203: R10.1 31.12,16.47 31.96,17.3 U6.8
PE1
  Top 0.203: R11.1 31.2,14.43 31.96,15.2 U6.9
RESET  (via drill 0.41)
  Top 0.203: v47.76,39.07 R6.1 | 42.34,15.54 42.02,15.22 U6.24 | 42.34,15.54 v42.65,15.86 | v17.15,46.29 13.49,46.29 12.88,46.89 U2.30 | v32.47,45.22 34.96,45.22 35.64,44.53 v42.27,44.53 | 42.34,15.54 42.27,15.6 41.05,15.6 37.09,11.64 37.09,11.56 35.82,10.29 31.02,10.29 29.52,8.79 29.52,5.29 27.03,2.8 J2.5 25.61,0.62 20.73,0.62 20,1.35 S1.1 S1.2
  Bottom 0.203: v42.65,15.86 47.76,20.96 v47.76,39.07 47.68,39.12 v42.27,44.53 | v17.15,46.29 19.41,48.55 29.14,48.55 v32.47,45.22
RX1  (via drill 0.41)
  Top 0.203: v5.75,11.66 7.09,10.32 Q3.2 | v4.58,15.09 3.92,15.09 3.56,15.45 R8.1 | v4.4,30.97 4.4,39.99 6.61,42.2 6.86,42.2 7.45,41.61 7.5,41.61 U2.45
  Bottom 0.203: v5.75,11.66 5.75,13.93 v4.58,15.09 4.53,15.17 3.64,16.06 3.64,29.04 4.4,29.8 v4.4,30.97
SCK  (via drill 0.41)
  Top 0.203: v16.06,44.02 16.26,44.02 18.78,46.54 U2.20 | v13.98,35.79 13.98,31.76 v14.69,31.05 | v27.79,7.12 25.74,5.06 25.74,3.28 J2.3 | U$4.SCK 41.84,2.14 40.44,3.54 39.78,3.54 38.84,4.48 38.84,5.14 38.11,5.87 31.91,5.87 v30.23,7.55
  Bottom 0.203: v16.06,44.02 16.06,43.59 13.98,41.51 v13.98,35.79 | v14.69,31.05 14.69,29.32 18.42,25.58 18.73,25.58 19.97,24.34 19.97,21.67 23.25,18.4 28.81,18.4 29.22,17.99 29.22,8.54 | v27.79,7.12 29.22,8.54 | v30.23,7.55 29.29,8.49 29.22,8.54
SCL  (via drill 0.41)
  Top 0.203: v8.16,29.19 6.22,27.25 | 6.22,27.25 5.8,26.83 Q1.3 | v8.34,39.88 8.34,40.9 8.82,41.38 8.82,41.71 U2.43 | v24.87,26.52 24.09,25.74 23.25,25.74 22.92,26.07 22.87,26.07 U3.23 | v31.93,29.06 v30.31,27.44 | U1.14 31.71,32.11 v31.93,32.11 v33.26,33.43 | v32.37,37.19 33.26,38.08 R2.1 | U$8.6 45.29,36.79 v45.12,36.61 | v5.62,27.84 6.22,27.25 | v12.35,15.42 14.18,13.6 v19.34,13.6 | v28.51,15.45 31.38,15.45 32.19,16.26 v32.7,16.26
  Bottom 0.203: v8.16,29.19 8.16,36.58 8.34,36.76 v8.34,39.88 | v24.87,26.52 28.12,26.52 29.04,27.44 29.78,27.44 | v30.31,27.44 29.78,27.44 | v31.93,32.11 v31.93,29.06 | v32.37,37.19 32.37,34.32 v33.26,33.43 33.33,33.41 37.7,33.41 40.9,36.61 v45.12,36.61 | v5.62,27.84 5.62,27.39 4.05,25.81 4.05,23.73 v12.35,15.42 | v19.34,13.6 26.65,13.6 v28.51,15.45 | v32.7,16.26 32.7,17.89 29.78,20.81 29.78,27.44
SDA  (via drill 0.41)
  Top 0.203: v34.96,34.12 31.68,30.84 31.68,30.54 U1.13 | v35.16,37.14 35.24,37.14 R1.1 36.07,37.85 37.09,36.84 37.09,35.77 36.56,35.24 31.35,35.24 v29.65,33.53 | U$8.7 47.73,38.06 v46.74,39.05 | 21.57,25.71 21.52,25.71 v19.16,23.35 | 21.57,25.71 22.49,25.71 U3.24 | Q2.3 v8.11,23.17 | v4.98,29.37 3.69,30.66 3.69,39.86 6.43,42.6 7.17,42.6 7.8,41.97 7.86,41.97 U2.44 | v20.25,27.11 21.57,25.79 21.57,25.71
  Bottom 0.203: 34.96,36.48 34.96,36.94 v35.16,37.14 | 34.96,36.48 v34.96,34.12 | v46.74,39.05 42.75,39.05 40.19,36.48 34.96,36.48 | v19.16,23.35 17.43,23.35 17.25,23.17 v8.11,23.17 8.06,23.25 8.06,26.42 5.11,29.37 v4.98,29.37 | v29.65,33.53 27.69,31.58 26.88,31.58 24.82,29.52 24.82,29.17 22.76,27.11 v20.25,27.11
TX1  (via drill 0.41)
  Top 0.203: R9.1 3.56,13.42 3.69,13.54 7.09,13.54 Q4.2 7.19,13.6 7.27,13.67 v8.19,13.67 | v10.37,15.86 10.37,28 4.81,33.56 4.81,37.37 7.78,40.34 7.78,40.57 7.17,41.18 U2.46
  Bottom 0.203: v8.19,13.67 v10.37,15.86

### Text on the board
tPlace: QuadAutomotive | Quad IMU | 9/2012